# Altium schematic sheet LTC_Hardware.SchDoc
size A4; SheetNumber: 4; SheetTotal: 10
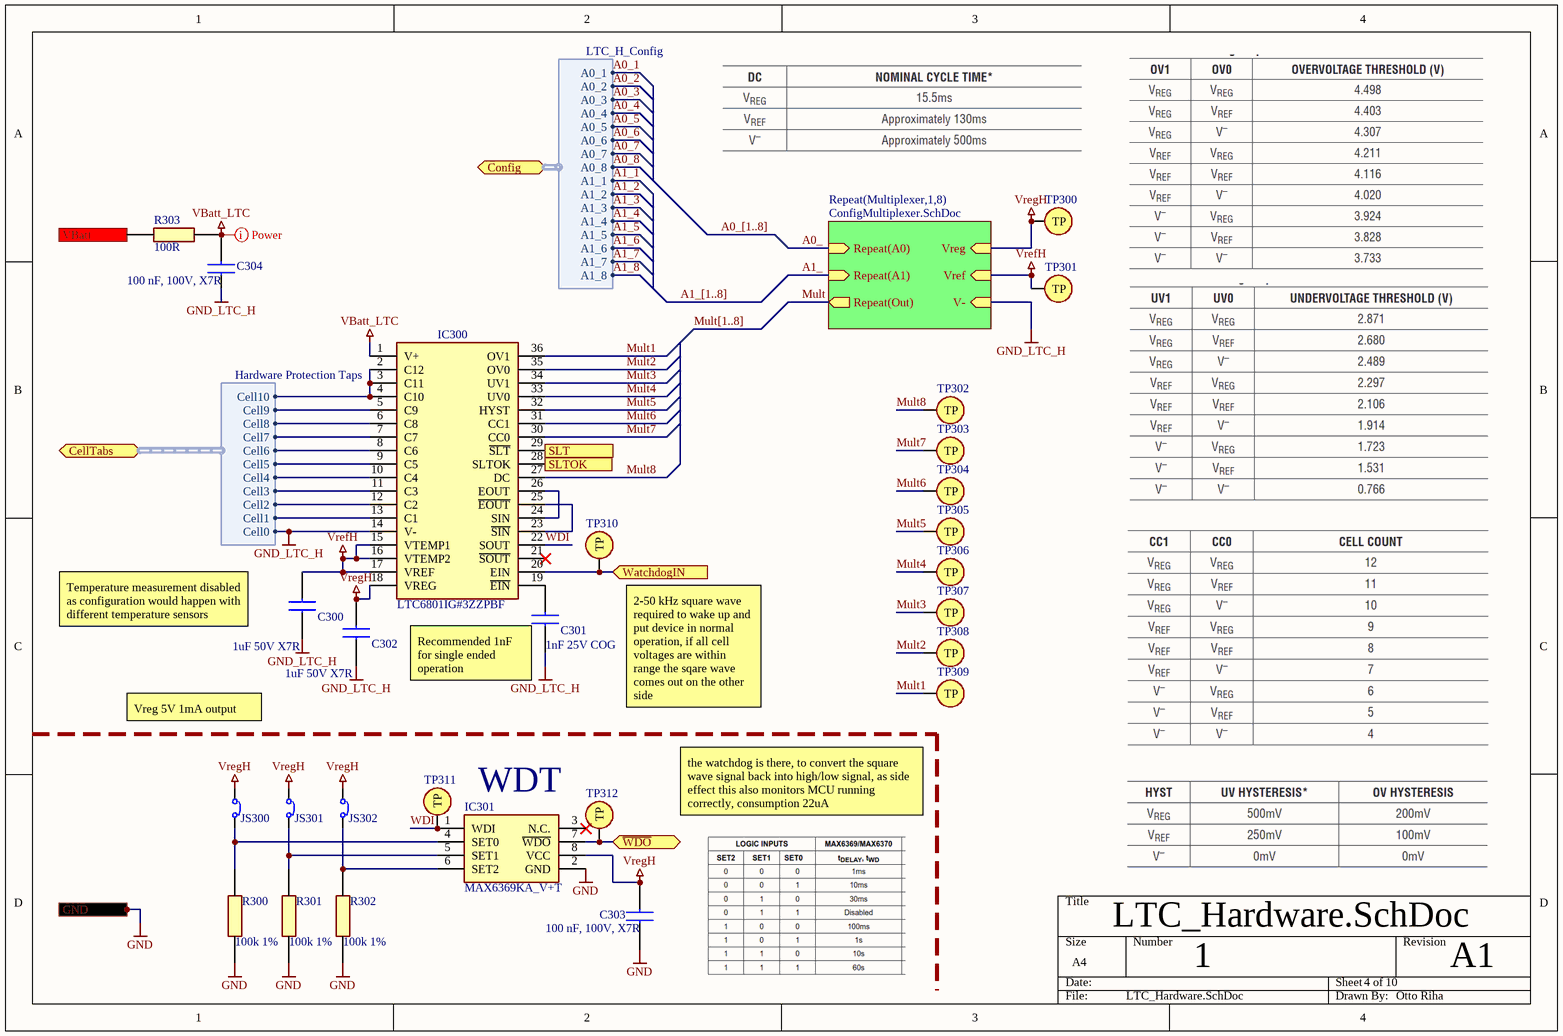
[diagram p0: LTC_Hardware.SchDoc]

## Parts
C300  1uF 50V X7R  [CAPC1608X90N]
C301  1nF 25V COG  [CAPC1608X90N]
C302  1uF 50V X7R  [CAPC1608X90N]
C303  100 nF, 100V, X7R  [MAJx16]
C304  100 nF, 100V, X7R  [MAJx16]
IC300  LTC6801IG#3ZZPBF  [SOP65P780X200-36N]
IC301  MAX6369KA_V+T  [SOT65P280X145-8N]
JS300  SolderJumper  [SolderJumper]  (value not drawn)
JS301  SolderJumper  [SolderJumper]  (value not drawn)
JS302  SolderJumper  [SolderJumper]  (value not drawn)
R300  100k 1%  [RESC1608X55N]
R301  100k 1%  [RESC1608X55N]
R302  100k 1%  [RESC1608X55N]
R303  value 100R  [RESC1608X50N]  (hidden comment: CRCW0603100RFKEA)
TP300  Testpoint  [Testpoint]  (value not drawn)
TP301  Testpoint  [Testpoint]  (value not drawn)
TP302  Testpoint  [Testpoint]  (value not drawn)
TP303  Testpoint  [Testpoint]  (value not drawn)
TP304  Testpoint  [Testpoint]  (value not drawn)
TP305  Testpoint  [Testpoint]  (value not drawn)
TP306  Testpoint  [Testpoint]  (value not drawn)
TP307  Testpoint  [Testpoint]  (value not drawn)
TP308  Testpoint  [Testpoint]  (value not drawn)
TP309  Testpoint  [Testpoint]  (value not drawn)
TP310  Testpoint  [Testpoint]  (value not drawn)
TP311  Testpoint  [Testpoint]  (value not drawn)
TP312  Testpoint  [Testpoint]  (value not drawn)

## Sub-sheets
Repeat(Multiplexer,1,8) = ConfigMultiplexer.SchDoc: Repeat(A0) (in), Repeat(A1) (in), Repeat(Out) (out), Vreg (in), Vref (in), V- (in)

## Ports
CellTabs (bidir, harness Hardware Protection Taps, see Main[4C]), Config (bidir, harness LTC_H_Config, see Main[4C]), GND (see Main[4C], AuxSupply_USB[1C], MCU[1A], PowerPath[1B], Singlepath[1C]), SLT (out, see Main[4C]), SLTOK (out, see Main[4C]), VBatt (in, see Main[4C]), WatchdogIN (in, see Main[4C]), ~{WDO} (bidir, see Main[4C])

## Harnesses
Hardware Protection Taps: Cell0, Cell1, Cell2, Cell3, Cell4, Cell5, Cell6, Cell7, Cell8, Cell9, Cell10
LTC_H_Config: A0_1, A0_2, A0_3, A0_4, A0_5, A0_6, A0_7, A0_8, A1_1, A1_2, A1_3, A1_4, A1_5, A1_6, A1_7, A1_8

## Nets
GND: C303.1 IC301.2(GND) R300.1 R301.1 R302.1 ; port GND
GND_LTC_H: C300.2 C301.1 C302.2 C304.1 IC300.14(V-) ; sheet Repeat(Multiplexer,1,8)/V-, port CellTabs.Cell0
VBatt_LTC: C304.2 IC300.1(V+) R303.2
VrefH: C300.1 IC300.15(VTEMP1) IC300.16(VTEMP2) IC300.17(VREF) TP301.1(TP) ; sheet Repeat(Multiplexer,1,8)/Vref
VregH: C302.1 C303.2 IC300.18(VREG) IC301.8(VCC) JS300.2 JS301.2 JS302.2 TP300.1(TP) ; sheet Repeat(Multiplexer,1,8)/Vreg
A0_: sheet Repeat(Multiplexer,1,8)/Repeat(A0)
A0_1: port Config.A0_1
A0_2: port Config.A0_2
A0_3: port Config.A0_3
A0_4: port Config.A0_4
A0_5: port Config.A0_5
A0_6: port Config.A0_6
A0_7: port Config.A0_7
A0_8: port Config.A0_8
A1_: sheet Repeat(Multiplexer,1,8)/Repeat(A1)
A1_1: port Config.A1_1
A1_2: port Config.A1_2
A1_3: port Config.A1_3
A1_4: port Config.A1_4
A1_5: port Config.A1_5
A1_6: port Config.A1_6
A1_7: port Config.A1_7
A1_8: port Config.A1_8
Mult: sheet Repeat(Multiplexer,1,8)/Repeat(Out)
Mult1: IC300.36(OV1) TP309.1(TP)
Mult2: IC300.35(OV0) TP308.1(TP)
Mult3: IC300.34(UV1) TP307.1(TP)
Mult4: IC300.33(UV0) TP306.1(TP)
Mult5: IC300.32(HYST) TP305.1(TP)
Mult6: IC300.31(CC1) TP304.1(TP)
Mult7: IC300.30(CC0) TP303.1(TP)
Mult8: IC300.27(DC) TP302.1(TP)
SLT: IC300.29(~{SLT}) ; port SLT
SLTOK: IC300.28(SLTOK) ; port SLTOK
VBatt: R303.1 ; port VBatt
~{WDO}: IC301.7(~{WDO}) TP312.1(TP) ; port ~{WDO}
WatchdogIN: IC300.20(EIN) TP310.1(TP) ; port WatchdogIN
WDI: IC300.22(SOUT) IC301.1(WDI) TP311.1(TP)
NetC301_2: C301.2 IC300.19(~{EIN})
NetIC300_2: IC300.2(C12) IC300.3(C11) IC300.4(C10) ; port CellTabs.Cell10
NetIC300_5: IC300.5(C9) ; port CellTabs.Cell9
NetIC300_6: IC300.6(C8) ; port CellTabs.Cell8
NetIC300_7: IC300.7(C7) ; port CellTabs.Cell7
NetIC300_8: IC300.8(C6) ; port CellTabs.Cell6
NetIC300_9: IC300.9(C5) ; port CellTabs.Cell5
NetIC300_10: IC300.10(C4) ; port CellTabs.Cell4
NetIC300_11: IC300.11(C3) ; port CellTabs.Cell3
NetIC300_12: IC300.12(C2) ; port CellTabs.Cell2
NetIC300_13: IC300.13(C1) ; port CellTabs.Cell1
NetIC300_23: IC300.23(~{SIN}) IC300.25(~{EOUT})
NetIC300_24: IC300.24(SIN) IC300.26(EOUT)
NetIC301_4: IC301.4(SET0) JS300.1 R300.2
NetIC301_5: IC301.5(SET1) JS301.1 R301.2
NetIC301_6: IC301.6(SET2) JS302.1 R302.2

Not connected (* = marked no-connect by the designer): IC300 21(~{SOUT})*; IC301 3(N.C.)*

## Buses and harness runs
bus A0_[1..8]
bus A1_[1..8]
bus Mult[1..8]

## Layout directives
net class Batt+: VBatt_LTC

## Notes on the sheet
- Temperature measurement disabled as configuration would happen with different temperature sensors
- Vreg 5V 1mA output
- (near C301) Recommended 1nF for single ended operation
- (near TP310) 2-50 kHz square wave required to wake up and put device in normal operation, if all cell voltages are within range the sqare wave comes out on the other side
- WDT
- the watchdog is there, to convert the square wave signal back into high/low signal, as side effect this also monitors MCU running correctly, consumption 22uA
- 1
- A1
- Otto Riha

## Library data of the parts
C300 C302 = 06035C105MAT2A: Capacitor 1uF 50V X7R; Manufacturer_Name: Kyocera AVX; Datasheet Link: https://componentsearchengine.com/Datasheets/1/06031A100FAT2A.pdf; Height: 0.9mm; Manufacturer_Part_Number: 06035C105MAT2A; Mouser Part Number: 581-06035C105MAT2A; Mouser Price/Stock: https://www.mouser.co.uk/ProductDetail/KYOCERA-AVX/06035C105MAT2A?qs=%252BdQmOuGyFcHMsevPtc6OZQ%3D%3D; Value: 1uF
C301 = 06033A102FAT2A: Capacitor 1nF 25V COG; Manufacturer_Name: Kyocera AVX; Datasheet Link: https://componentsearchengine.com/Datasheets/1/06031A100FAT2A.pdf; Height: 0.9mm; Manufacturer_Part_Number: 06033A102FAT2A; Mouser Part Number: 581-06033A102F; Mouser Price/Stock: https://www.mouser.com/Search/Refine.aspx?Keyword=581-06033A102F; Value: 1nF
C303 C304 = MAJCH168BB7104KTEA01: Capacitor 100nF, 100V, X7R; Manufacturer_Name: TAIYO YUDEN; Datasheet Link: https://ds.yuden.co.jp/TYCOMPAS/or/detail?pn=MAJCH168BB7104KTEA01; Height: 0.8mm; Manufacturer_Part_Number: MAJCH168BB7104KTEA01; Mouser Part Number: 963-MAJCH168BB7104KT; Mouser Price/Stock: https://www.mouser.co.uk/ProductDetail/TAIYO-YUDEN/MAJCH168BB7104KTEA01?qs=ZcfC38r4PovaTBrG0IdezQ%3D%3D; Arrow Part Number: MAJCH168BB7104KTEA01; Arrow Price/Stock: https://www.arrow.com/en/products/majch168bb7104ktea01/taiyo-yuden?utm_currency=USD&region=nac; Supplier 1: Mouser; Supplier Part Number 1: 963-MAJCH168BB7104KT
IC300 = LTC6801IG#3ZZPBF: Integrated Circuit; Manufacturer_Name: Analog Devices; Datasheet Link: https://www.analog.com/LTC6801/datasheet; Height: 2mm; Manufacturer_Part_Number: LTC6801IG#3ZZPBF; Mouser Part Number: 584-LTC6801IG#3ZZPBF; Mouser Price/Stock: https://www.mouser.com/Search/Refine.aspx?Keyword=584-LTC6801IG%233ZZPBF; Arrow Part Number: LTC6801IG#3ZZPBF; Arrow Price/Stock: https://www.arrow.com/en/products/ltc6801ig3zzpbf/analog-devices
IC301 = MAX6369KA_V+T: Integrated Circuit; Manufacturer_Name: Analog Devices; Manufacturer_Part_Number: MAX6369KA/V+T; Datasheet Link: https://pdfserv.maximintegrated.com/en/ds/MAX6369-MAX6374.pdf; Height: 1.45mm; Mouser Part Number: 700-MAX6369KA/V+T; Mouser Price/Stock: https://www.mouser.co.uk/ProductDetail/Analog-Devices-Maxim-Integrated/MAX6369KA-V%2bT?qs=Mc2rGIXtnyXSLiZoc8BdSg%3D%3D; Arrow Part Number: MAX6369KA/V+T; Arrow Price/Stock: https://www.arrow.com/en/products/max6369kavt/maxim-integrated?region=nac
R300-R302 = CRCW0603100KFKEAC: Resistor 100k, 1%; Manufacturer_Name: Vishay; Datasheet Link: https://www.mouser.com/datasheet/2/427/crcwce3-1223726.pdf; Height: 0.55mm; Manufacturer_Part_Number: CRCW0603100KFKEAC; Mouser Part Number: 71-CRCW0603100KFKEAC; Mouser Price/Stock: https://www.mouser.co.uk/ProductDetail/Vishay-Dale/CRCW0603100KFKEAC?qs=E3Y5ESvWgWPxzfNYyMgX1w%3D%3D; Arrow Part Number: CRCW0603100KFKEAC; Arrow Price/Stock: https://www.arrow.com/en/products/crcw0603100kfkeac/vishay?utm_currency=USD&region=nac; Value: 100k; Supplier 1: Mouser; Supplier Part Number 1: 71-CRCW0603100KFKEAC
R303 = CRCW0603100RFKEA: Resistor 100R, 1%; Manufacturer_Name: Vishay; Datasheet Link: http://www.vishay.com/docs/20035/dcrcwe3.pdf; Height: 0.5mm; Manufacturer_Part_Number: CRCW0603100RFKEA; Mouser Part Number: 71-CRCW0603-100-E3; Mouser Price/Stock: https://www.mouser.co.uk/ProductDetail/Vishay-Dale/CRCW0603100RFKEA?qs=90AHS1y%2FsidGWjjxZAupKg%3D%3D; Arrow Part Number: CRCW0603100RFKEA; Arrow Price/Stock: https://www.arrow.com/en/products/crcw0603100rfkea/vishay?utm_currency=USD&region=europe; Supplier 1: Mouser; Supplier Part Number 1: 71-CRCW0603-100-E3